# Altium schematic sheet [7] Display.SchDoc
size A3; Author: Caner ALP; Organization: ALP Electronics; Address1: Axel Oxenstiernas; Address2: Västerås; Address3: 72478; Address4: Sweden; DocumentNumber: 7; SheetNumber: 7; SheetTotal: 7
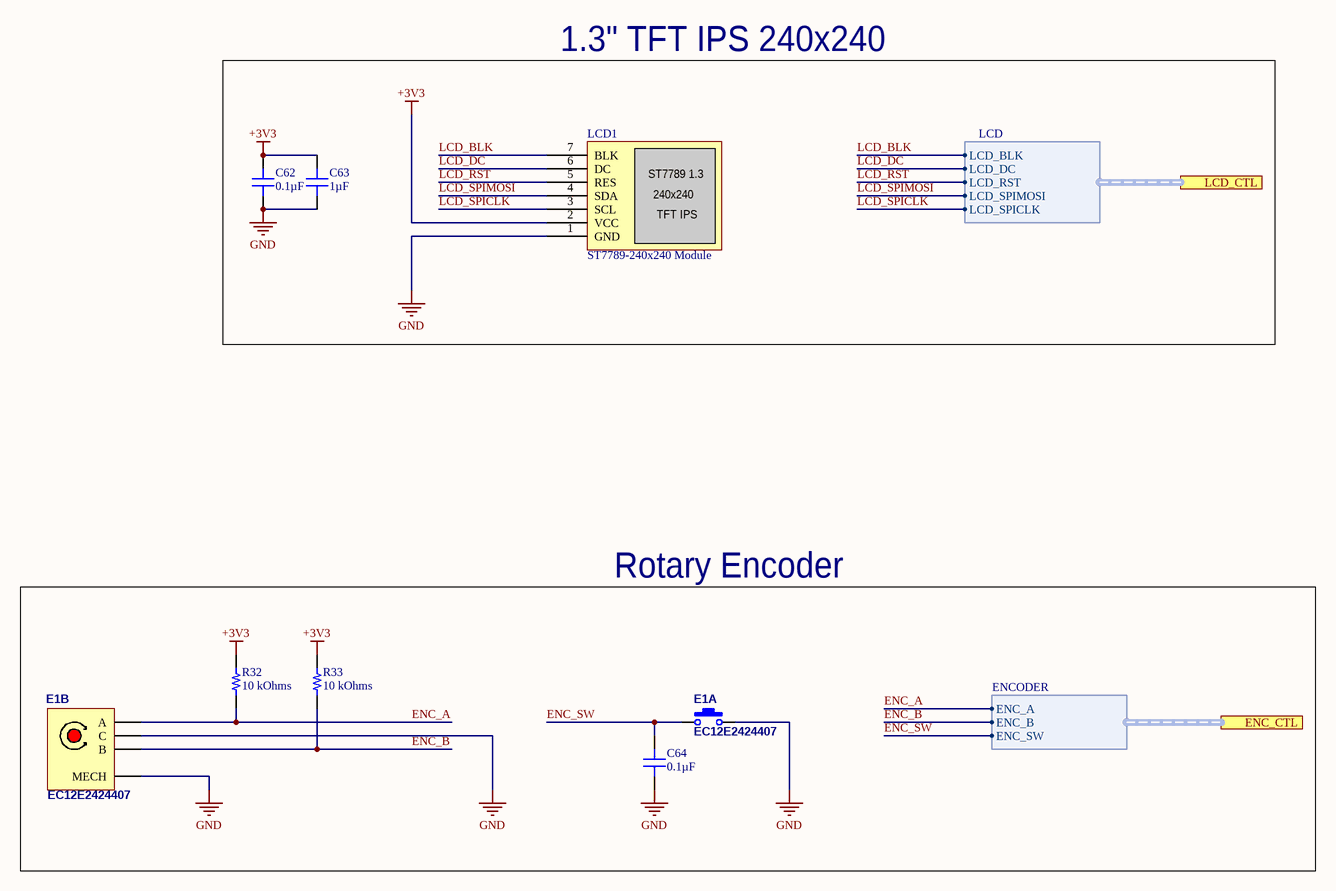
[diagram p0: [7] Display.SchDoc]

## Parts
C62  0.1µF  [CAP 0603_1608]
C63  1µF  [CAP 0603_1608]
C64  0.1µF  [CAP 0603_1608]
E1  EC12E2424407  [EC12E242]  (parts A,B of 2)
LCD1  ST7789-240x240 Module  [1.3 TFT IPS - Module]
R32  10 kOhms  [RES 0603_1608]
R33  10 kOhms  [RES 0603_1608]

## Blocks framed on the sheet
1.3" TFT IPS 240x240: C62 C63 LCD1
Rotary Encoder: C64 E1 R32 R33

## Ports
ENC_CTL (harness ENCODER), LCD_CTL (harness LCD)

## Harnesses
LCD: LCD_BLK, LCD_DC, LCD_RST, LCD_SPIMOSI, LCD_SPICLK
ENCODER: ENC_A, ENC_B, ENC_SW

## Nets
+3V3: C62.1 C63.2 LCD1.2(VCC) R32.2 R33.2
GND: C62.2 C63.1 C64.2 E1.C E1.M(MECH) E1.S2 LCD1.1(GND)
ENC_A: E1.A R32.1 ; port ENC_CTL.ENC_A
ENC_B: E1.B R33.1 ; port ENC_CTL.ENC_B
ENC_SW: C64.1 E1.S1 ; port ENC_CTL.ENC_SW
LCD_BLK: LCD1.7(BLK) ; port LCD_CTL.LCD_BLK
LCD_DC: LCD1.6(DC) ; port LCD_CTL.LCD_DC
LCD_RST: LCD1.5(RES) ; port LCD_CTL.LCD_RST
LCD_SPICLK: LCD1.3(SCL) ; port LCD_CTL.LCD_SPICLK
LCD_SPIMOSI: LCD1.4(SDA) ; port LCD_CTL.LCD_SPIMOSI

## Notes on the sheet
- Title
- Size:
- Project
- A3
- Revision:
- Date:
- Sheet
- of
- (in symbol ST7789-240x240 Module) ST7789 1.3; 240x240; TFT IPS

## Library data of the parts
C62 C64 = 0603BB104K500NGT: CAP CER 0.1UF 50V X7R 0603; Manufacturer: Knowles Novacap; Tolerance: ±10%; Part Number: 0603BB104K500NGT; Value: 0.1µF; Applications: General Purpose; Capacitance: 0.1µF; ComponentLink1Description: Datasheet; ComponentLink1URL: https://www.knowlescapacitors.com/getattachment/6c8d48ef-fc2b-4752-ae2c-ce6c208de0c4/High-Capacitance-Chip.aspx; ComponentLink2Description: DigiKey Link; ComponentLink2URL: http://digikey.com/product-detail/en/knowles-novacap/0603BB104K500NGT/1763-1146-1-ND/7304094; Device Package: 0603 (1608 Metric); Features: Gold Flash Termination; LastUpdated: 21/01/2020 00:02:02; Lifecycle Status: Active; Minimum Order: 1; Mounting Type: Surface Mount, MLCC; Operating Temperature: -55°C ~ 125°C; Package / Case: 0603 (1608 Metric); Packaging: TapeAndReel; PartId: 7006; Part Status: Active; Price: 0.56; Series: -; Size / Dimension: 0.060" L x 0.030" W (1.52mm x 0.76mm); Supplier 1: DigiKey; Supplier Part Number 1: 1763-1146-1-ND; Temperature Coefficient: X7R; Thickness (Max): 0.035" (0.89mm); Voltage - Rated: 50V
C63 = 0603BB105K160YT: CAP CER 1UF 16V X7R 0603; Manufacturer: Knowles Novacap; Tolerance: ±10%; Part Number: 0603BB105K160YT; Value: 1µF; Applications: General Purpose; Capacitance: 1µF; ComponentLink1Description: Datasheet; ComponentLink1URL: https://www.knowlescapacitors.com/getattachment/6c8d48ef-fc2b-4752-ae2c-ce6c208de0c4/High-Capacitance-Chip.aspx; ComponentLink2Description: DigiKey Link; ComponentLink2URL: http://digikey.com/product-detail/en/knowles-novacap/0603BB105K160YT/1763-1175-1-ND/7304294; Device Package: 0603 (1608 Metric); LastUpdated: 21/01/2020 00:02:02; Lifecycle Status: Active; Minimum Order: 1; Mounting Type: Surface Mount, MLCC; Operating Temperature: -55°C ~ 125°C; Package / Case: 0603 (1608 Metric); Packaging: TapeAndReel; PartId: 6996; Part Status: Active; Price: 0.51; Series: -; Size / Dimension: 0.060" L x 0.030" W (1.52mm x 0.76mm); Supplier 1: DigiKey; Supplier Part Number 1: 1763-1175-1-ND; Temperature Coefficient: X7R; Thickness (Max): 0.035" (0.89mm); Voltage - Rated: 16V
E1 = EC12E2424407: Alps 20mm, 24PPR+SW Encoder
LCD1 = ST7789-240x240 Module: LCD TFT IPS 1.3" 240x240; Part Number: ST7789-240x240 Module; PartId: 7912
R32 R33 = CRCW060310K0JNEA: RES SMD 10K OHM 5% 1/10W 0603; Manufacturer: Vishay Dale; Power (Watts): 0.1W, 1/10W; Temperature Coefficient: ±200ppm/°C; Part Number: CRCW060310K0JNEA; Value: 10 kOhms; ComponentLink1Description: Datasheet; ComponentLink1URL: http://www.vishay.com/docs/20035/dcrcwe3.pdf; ComponentLink2Description: DigiKey Link; ComponentLink2URL: http://digikey.com/product-detail/en/vishay-dale/CRCW060310K0JNEA/541-10KGCT-ND/1179393; Composition: Thick Film; Device Package: 0603 (1608 Metric); Features: Automotive AEC-Q200; Height - Seated (Max): 0.020" (0.50mm); LastUpdated: 21/01/2020 00:24:50; Lifecycle Status: Active; Minimum Order: 1; Number of Terminations: 2; Operating Temperature: -55°C ~ 155°C; Package / Case: 0603 (1608 Metric); Packaging: CutTape; PartId: 5216; Part Status: Active; Price: 0.10; Ratings: AEC-Q200; Resistance: 10 kOhms; Series: CRCW; Size / Dimension: 0.063" L x 0.033" W (1.60mm x 0.85mm); Supplier 1: DigiKey; Supplier Part Number 1: 541-10KGCT-ND; Supplier Device Package: 0603; Tolerance: ±5%